# EAGLE design logic (EAGLE 7.5.0)
AUTHOR: Dave Vandenbout / XESS Corp.; VERSION#: 1.0
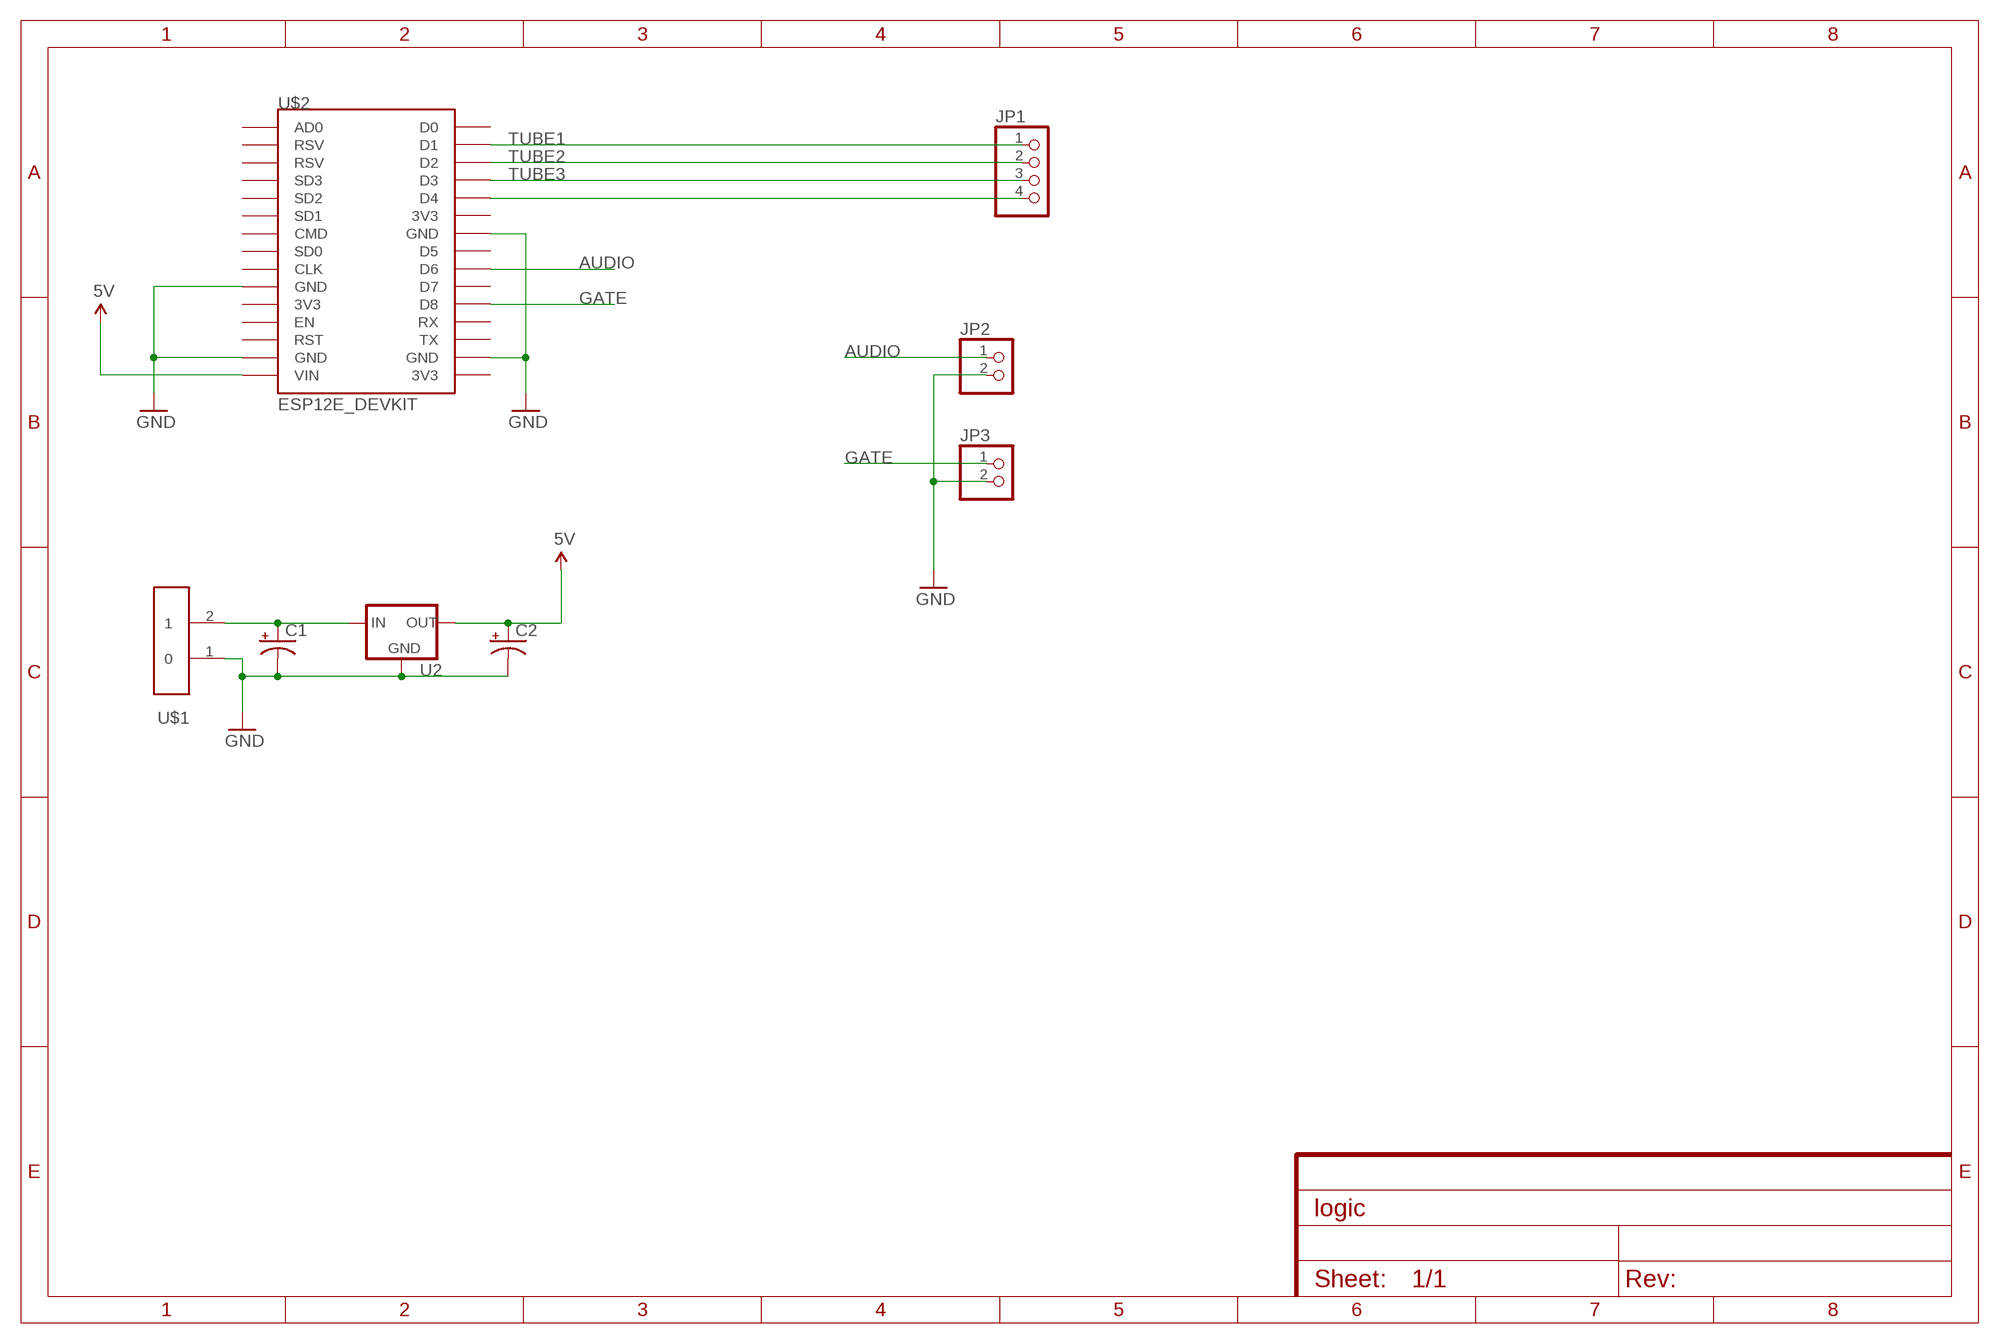
[diagram p0: schematic, sheet 1]

## Parts
C1  10UF-25V-20%(PTH)  [CPOL-RADIAL-10UF-25V]
C2  10UF-25V-20%(PTH)  [CPOL-RADIAL-10UF-25V]
JP1  PINHD-1X4  [1X04]
JP2  PINHD-1X2  [1X02]
JP3  PINHD-1X2  [1X02]
U2  V_REG_78XXSINK  [TO220-IGO]
U$1  ED2609  [ED2609]
U$2  ESP12E_DEVKIT  [ESP12E_DEVKIT]

## Nets
5V: C2.1(+) U2.OUT U$2.VIN
AUDIO: JP2.1 U$2.D6
GATE: JP3.1 U$2.D8
GND: C1.2(-) C2.2(-) JP2.2 JP3.2 U2.GND U$1.1 U$2.GND@0(GND) U$2.GND@1(GND) U$2.GND@2(GND) U$2.GND@3(GND)
N$1: C1.1(+) U2.IN U$1.2
N$2: JP1.4 U$2.D4
TUBE1: JP1.1 U$2.D1
TUBE2: JP1.2 U$2.D2
TUBE3: JP1.3 U$2.D3
Unconnected: U$2.3V3@0(3V3) U$2.3V3@1(3V3) U$2.3V3@2(3V3) U$2.AD0 U$2.CLK U$2.CMD U$2.D0 U$2.D5 U$2.D7 U$2.EN U$2.RST U$2.RSV@0(RSV) U$2.RSV@1(RSV) U$2.RX U$2.SD0 U$2.SD1 U$2.SD2 U$2.SD3 U$2.TX

## Library data of the parts
C1 C2 = SparkFun-Capacitors:10UF-25V-20%(PTH): CAP-08440; PROD_ID: CAP-08440
JP1 = pinhead:PINHD-1X4: PIN HEADER
JP2 JP3 = pinhead:PINHD-1X2: PIN HEADER
U2 = SparkFun-PowerIC:V_REG_78XX: Voltage Regulator Standard 78xx regulator. IGO (Input Ground Output). Spark Fun Electronics SKU : COM-00107
U$1 = muon-tube:ED2609
U$2 = muon-tube:ESP12E_DEVKIT: ESP12E DEVKIT BOARD

## Net classes
1 power: clearance 0.254 mm

## Board
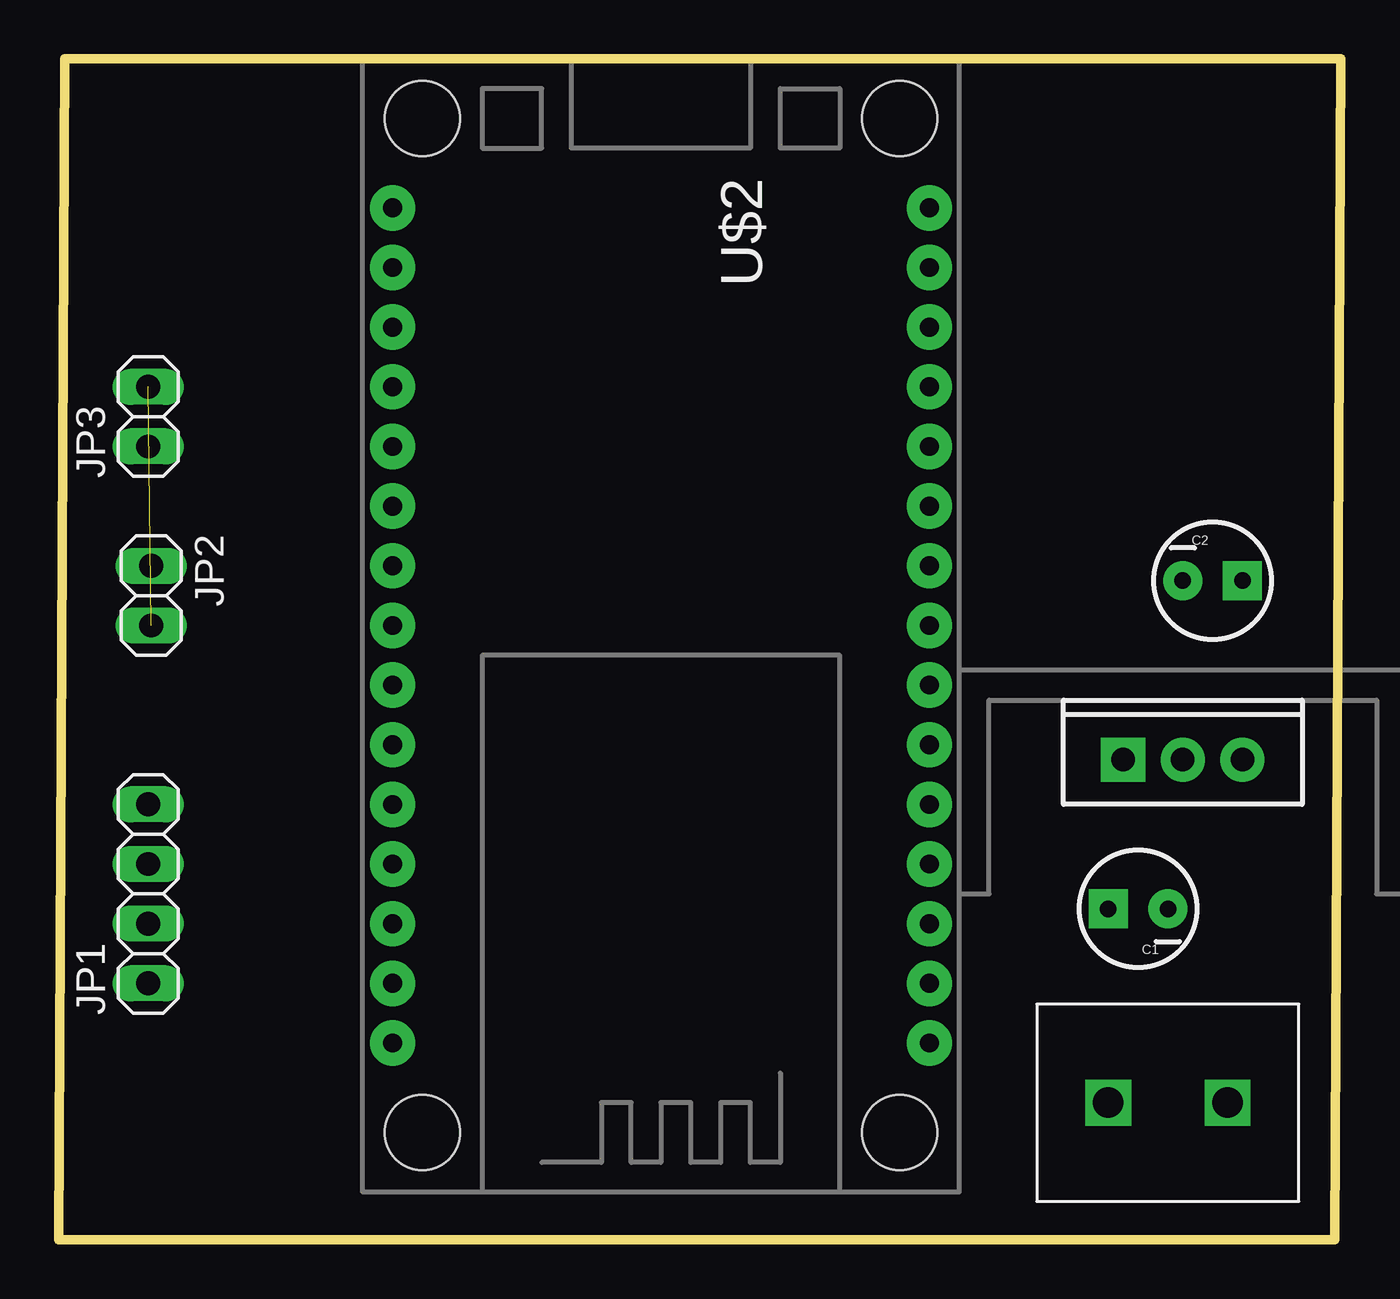
[diagram p1: board, top side]
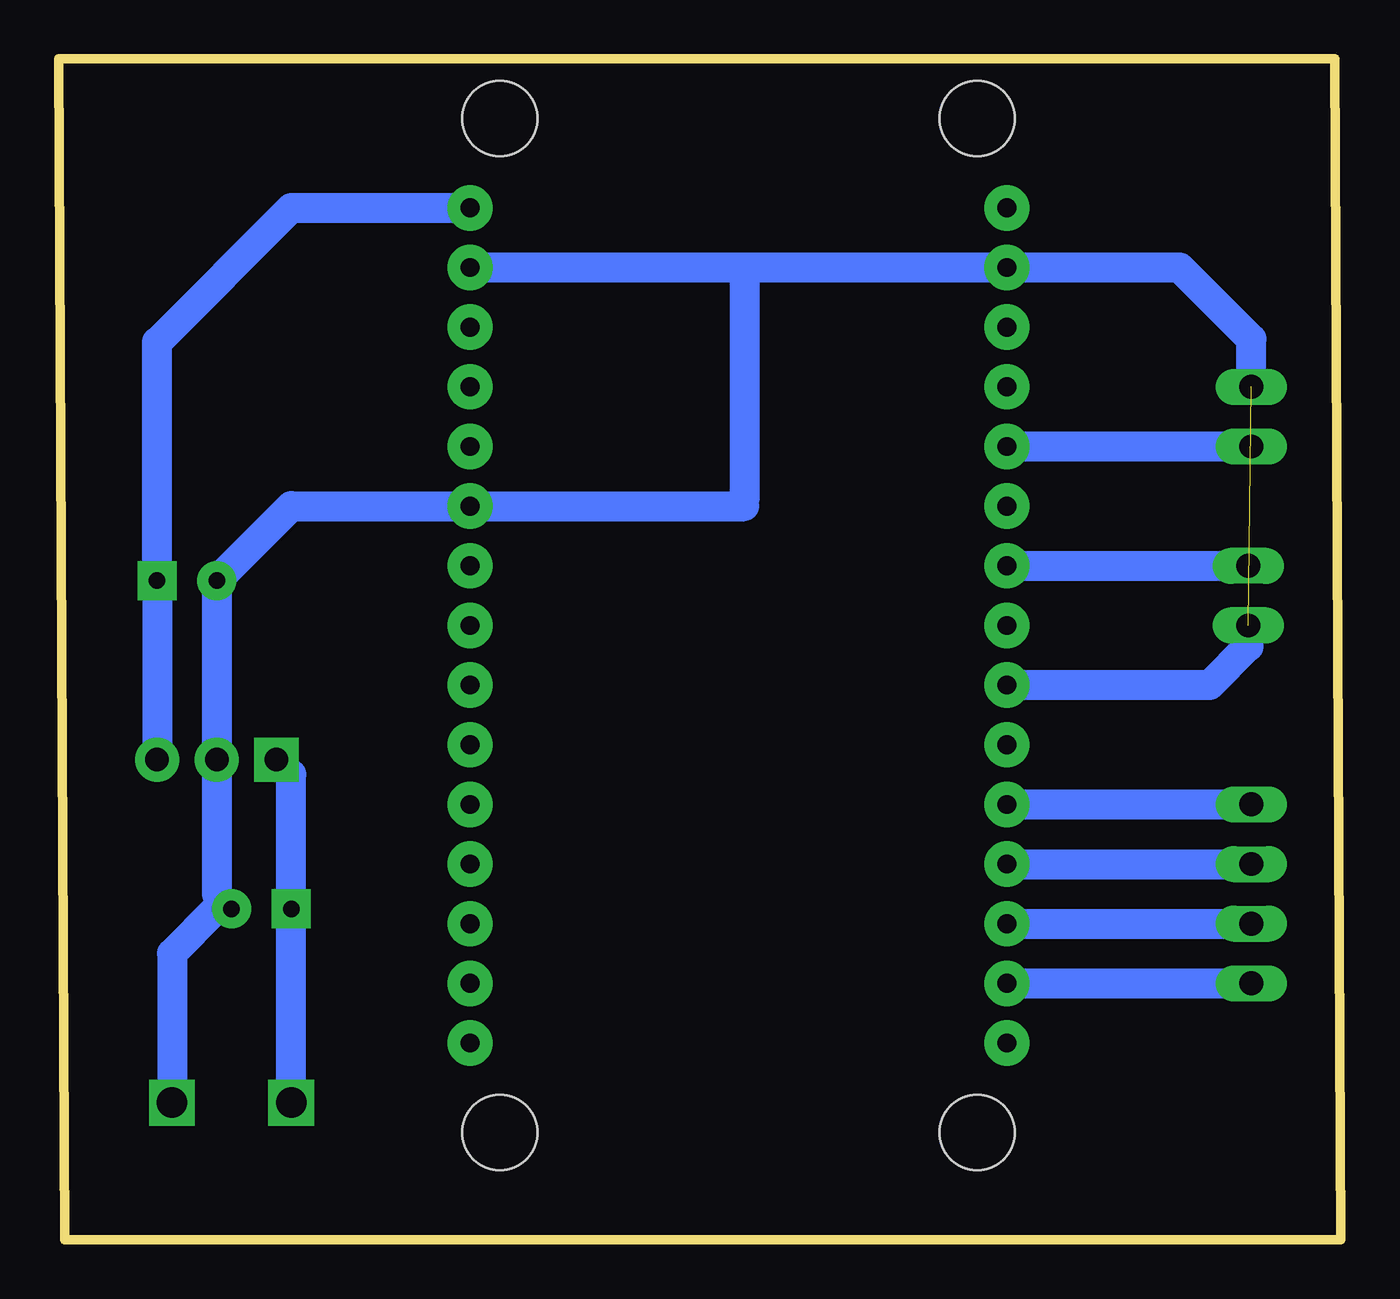
[diagram p2: board, bottom side, seen from below]

Size 54.61 x 50.29 mm. Coordinates in mm from the lower left corner, seen from the top.
Outline: 0,0 54.36,0 54.61,50.29 0.25,50.29 0,0
Copper layers (1*16): Top 0.035mm / dielectric 1.5mm / Bottom 0.035mm
Design rules "ITeadstudio_safe": minimum track width 8mil, minimum drill 12mil, track to track 8mil, track to pad 8mil, pad to pad 8mil, via to via 8mil, smd to smd 0mil, copper to edge 10mil, drill to drill 10mil, minimum pad ring 10mil, minimum via ring 8mil, stop-mask expansion 2mil, vias tented up to drill 100mil, thermal gap 10mil

### Footprints (pad centres in the part's own frame; a part is rotated, then mirrored left to right if it is on the bottom)
CPOL-RADIAL-10UF-25V = drill 0.7 pad 1.651 square: 1 1.27,0 | drill 0.7 pad 1.651: 2 -1.27,0
1X04 = drill 1.016 long: 1 -3.81,0; 2 -1.27,0; 3 1.27,0; 4 3.81,0
1X02 = drill 1.016 long: 1 -1.27,0; 2 1.27,0
TO220-IGO = drill 1 pad 1.88: GND 0,0; OUT 2.54,0 | drill 1 pad 1.88 square: IN -2.54,0
ED2609 = drill 1.3 square: 1 0,0; 2 5.08,0
ESP12E_DEVKIT = drill 0.8 pad 1.93: 3V3@0 -11.43,-7.62; 3V3@1 11.43,5.08; 3V3@2 11.43,-17.78; AD0 -11.43,17.78; CLK -11.43,-2.54; CMD -11.43,2.54; D0 11.43,17.78; D1 11.43,15.24; D2 11.43,12.7; D3 11.43,10.16; D4 11.43,7.62; D5 11.43,0; D6 11.43,-2.54; D7 11.43,-5.08; D8 11.43,-7.62; EN -11.43,-10.16; GND@0 -11.43,-5.08; GND@1 -11.43,-15.24; GND@2 11.43,2.54; GND@3 11.43,-15.24; RST -11.43,-12.7; RSV@0 -11.43,15.24; RSV@1 -11.43,12.7; RX 11.43,-10.16; SD0 -11.43,0; SD1 -11.43,5.08; SD2 -11.43,7.62; SD3 -11.43,10.16; TX 11.43,-12.7; VIN -11.43,-17.78 | hole 3.2: -10.16,21.59; 10.16,21.59; 10.16,-21.59; -10.16,-21.59

### Placement (x,y rotation side)
C1  45.97,14.1 180 top
C2  49.15,28.07 0 top
JP1  3.81,14.73 90 top
JP2  3.94,27.43 270 top
JP3  3.81,35.05 90 top
U2  47.88,20.45 0 top
U$1  49.78,5.84 180 top
U$2  25.65,26.16 180 top

### Tracks (layer width: path | path; a pad name or v marks a point on that pad's centre or on a via)
5V
  Bottom 1.27: U$2.VIN 44.7,43.94 50.42,38.23 C2.1 U2.OUT
AUDIO
  Bottom 1.27: U$2.D6 JP2.1
GATE
  Bottom 1.27: U$2.D8 JP3.1
GND  (1 unrouted)
  Bottom 0.406: 47.88,14.73 C1.2 47.88,14.1
  Bottom 1.27: 47.88,14.73 U2.GND C2.2 44.7,31.24 U$2.GND@0 25.65,31.24 | 47.88,14.1 49.78,12.19 U$1.1 | JP3.2 3.81,38.35 6.86,41.4 U$2.GND@3 25.4,41.4 | JP2.2 3.94,25.27 5.59,23.62 U$2.GND@2 | 25.4,41.4 U$2.GND@1 | 25.65,31.24 25.4,31.24 | 25.4,41.4 25.4,31.5 25.65,31.24
N$1
  Bottom 0.406: 44.7,19.81 U2.IN
  Bottom 1.27: U$1.2 C1.1 44.7,19.81
N$2
  Bottom 1.27: U$2.D4 JP1.4
TUBE1
  Bottom 1.27: U$2.D1 JP1.1
TUBE2
  Bottom 1.27: U$2.D2 JP1.2
TUBE3
  Bottom 1.27: U$2.D3 JP1.3